# EAGLE schematic MainBoard (EAGLE 6.4)
Modyfikacja testera VFS169

## Sheet 1 of 10
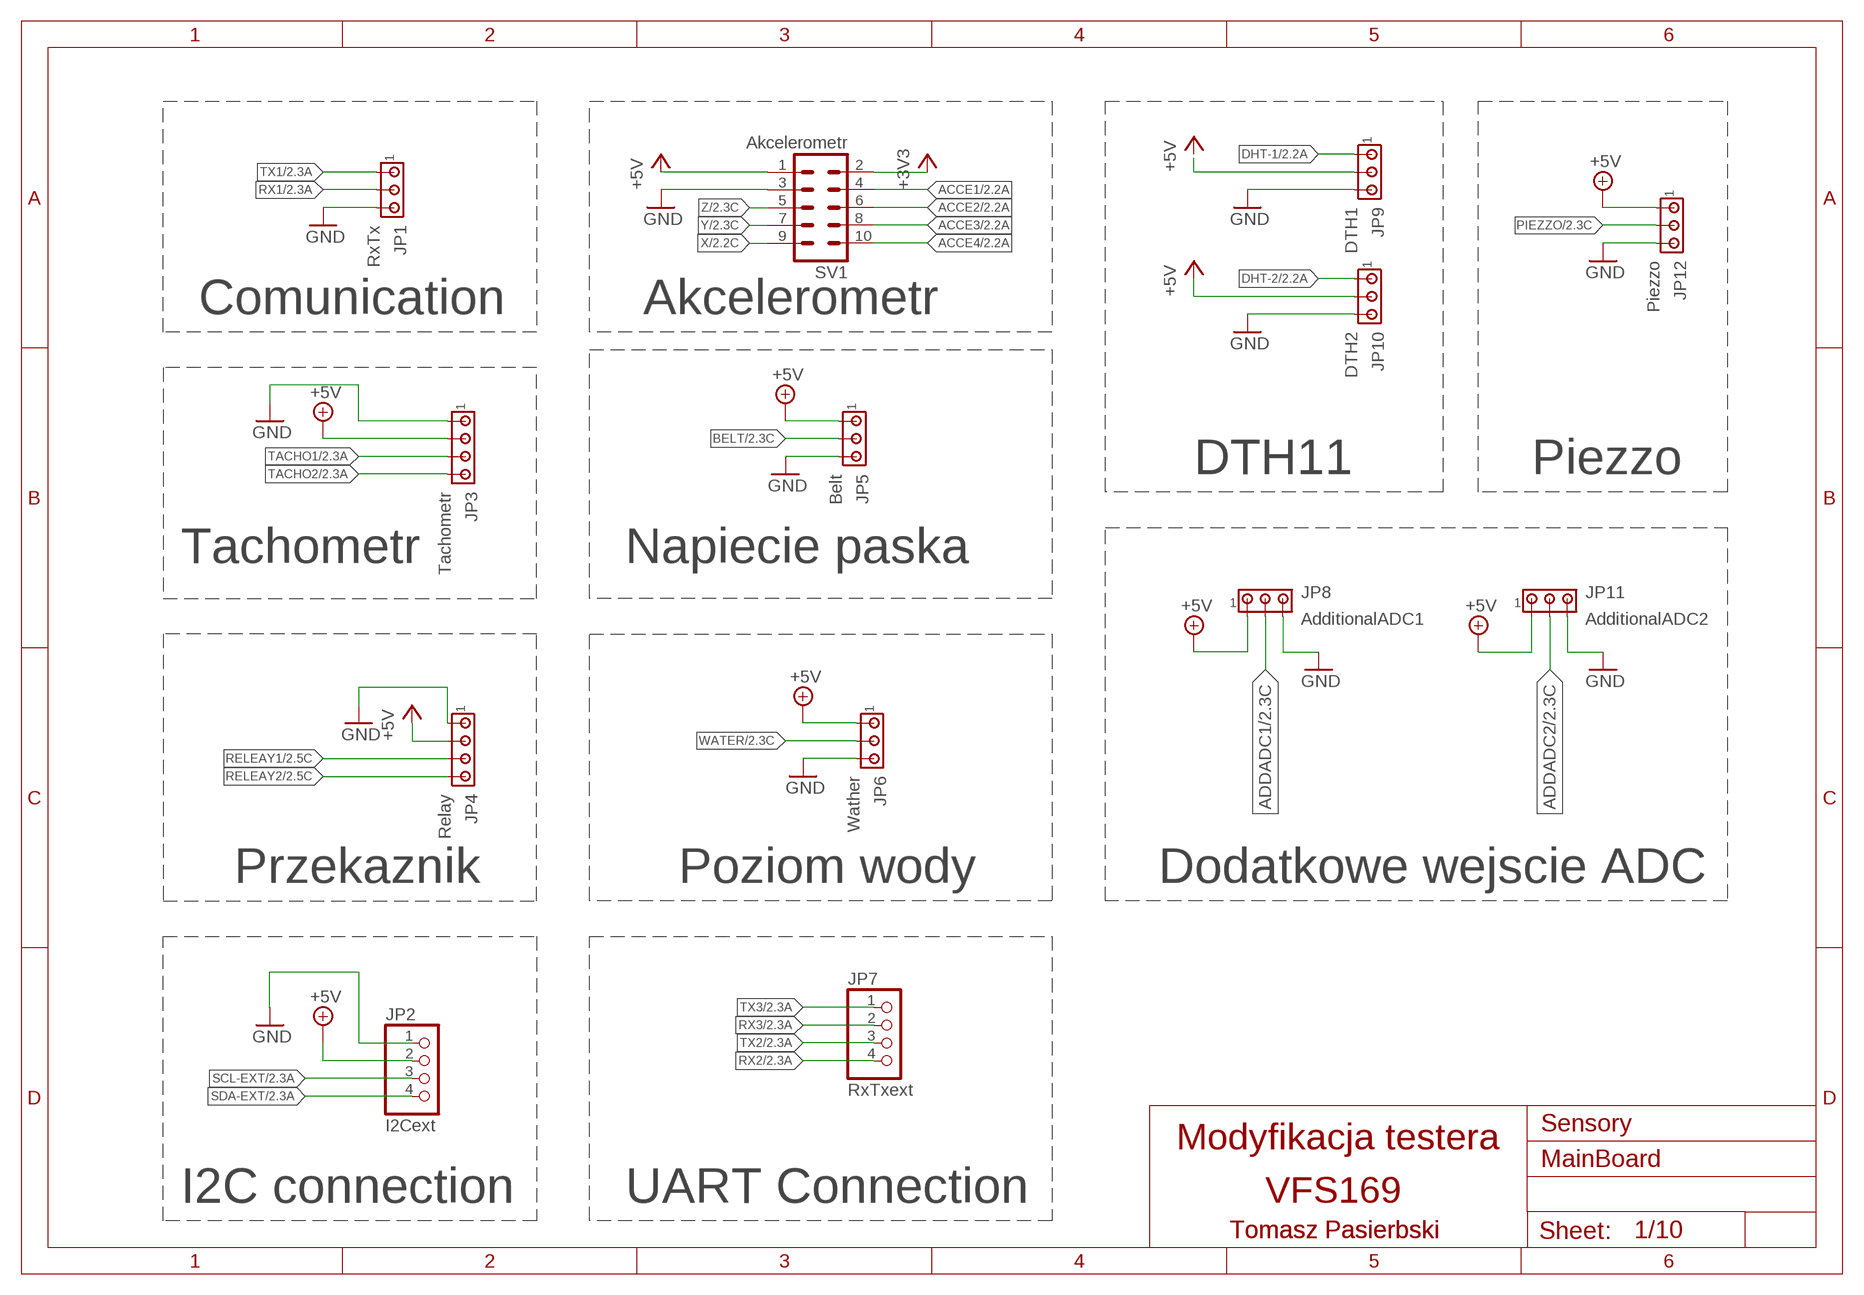
[diagram p0: schematic, sheet 1]

### Parts
JP1  RxTx  MTA03-100  [10X03MTA]
JP2  I2Cext  PINHD-1X4  [1X04]
JP3  Tachometr  MTA04-100  [10X04MTA]
JP4  Relay  MTA04-100  [10X04MTA]
JP5  Belt  MTA03-100  [10X03MTA]
JP6  Wather  MTA03-100  [10X03MTA]
JP7  RxTxext  PINHD-1X4  [1X04]
JP8  AdditionalADC1  MTA03-100  [10X03MTA]
JP9  DTH1  MTA03-100  [10X03MTA]
JP10  DTH2  MTA03-100  [10X03MTA]
JP11  AdditionalADC2  MTA03-100  [10X03MTA]
JP12  Piezzo  MTA03-100  [10X03MTA]
SV1  Akcelerometr  ML10  [ML10]

### Nets
+3V3: SV1.2 ; also sheet 2,7
+5V: JP2.2 JP3.2 JP4.2 JP5.1 JP6.1 JP8.1 JP9.2 JP10.2 JP11.1 JP12.1 SV1.1 ; also sheet 2,3,4,5,6,7,8,9
ACCE1: SV1.4 ; also sheet 2
ACCE2: SV1.6 ; also sheet 2
ACCE3: SV1.8 ; also sheet 2
ACCE4: SV1.10 ; also sheet 2
ADDADC1: JP8.2 ; also sheet 2
ADDADC2: JP11.2 ; also sheet 2
BELT: JP5.2 ; also sheet 2
DHT-1: JP9.1 ; also sheet 2
DHT-2: JP10.1 ; also sheet 2
GND: JP1.3 JP2.1 JP3.1 JP4.1 JP5.3 JP6.3 JP8.3 JP9.3 JP10.3 JP11.3 JP12.3 SV1.3 ; also sheet 2,3,4,5,6,7,8,9
PIEZZO: JP12.2 ; also sheet 2
RELEAY1: JP4.3 ; also sheet 2
RELEAY2: JP4.4 ; also sheet 2
RX1: JP1.2 ; also sheet 2
RX2: JP7.4 ; also sheet 2
RX3: JP7.2 ; also sheet 2
SCL-EXT: JP2.3 ; also sheet 2
SDA-EXT: JP2.4 ; also sheet 2
TACHO1: JP3.3 ; also sheet 2
TACHO2: JP3.4 ; also sheet 2
TX1: JP1.1 ; also sheet 2
TX2: JP7.3 ; also sheet 2
TX3: JP7.1 ; also sheet 2
WATER: JP6.2 ; also sheet 2
X: SV1.9 ; also sheet 2
Y: SV1.7 ; also sheet 2
Z: SV1.5 ; also sheet 2

### Notes on the sheet
- Comunication | Akcelerometr
- DTH11 | Piezzo
- Tachometr | Napiecie paska
- Przekaznik | Poziom wody | Dodatkowe wejscie ADC
- Sensory
- Modyfikacja testera
- I2C connection | UART Connection | VFS169
- Tomasz Pasierbski | Tomasz Pasierbski

## Sheet 2 of 10
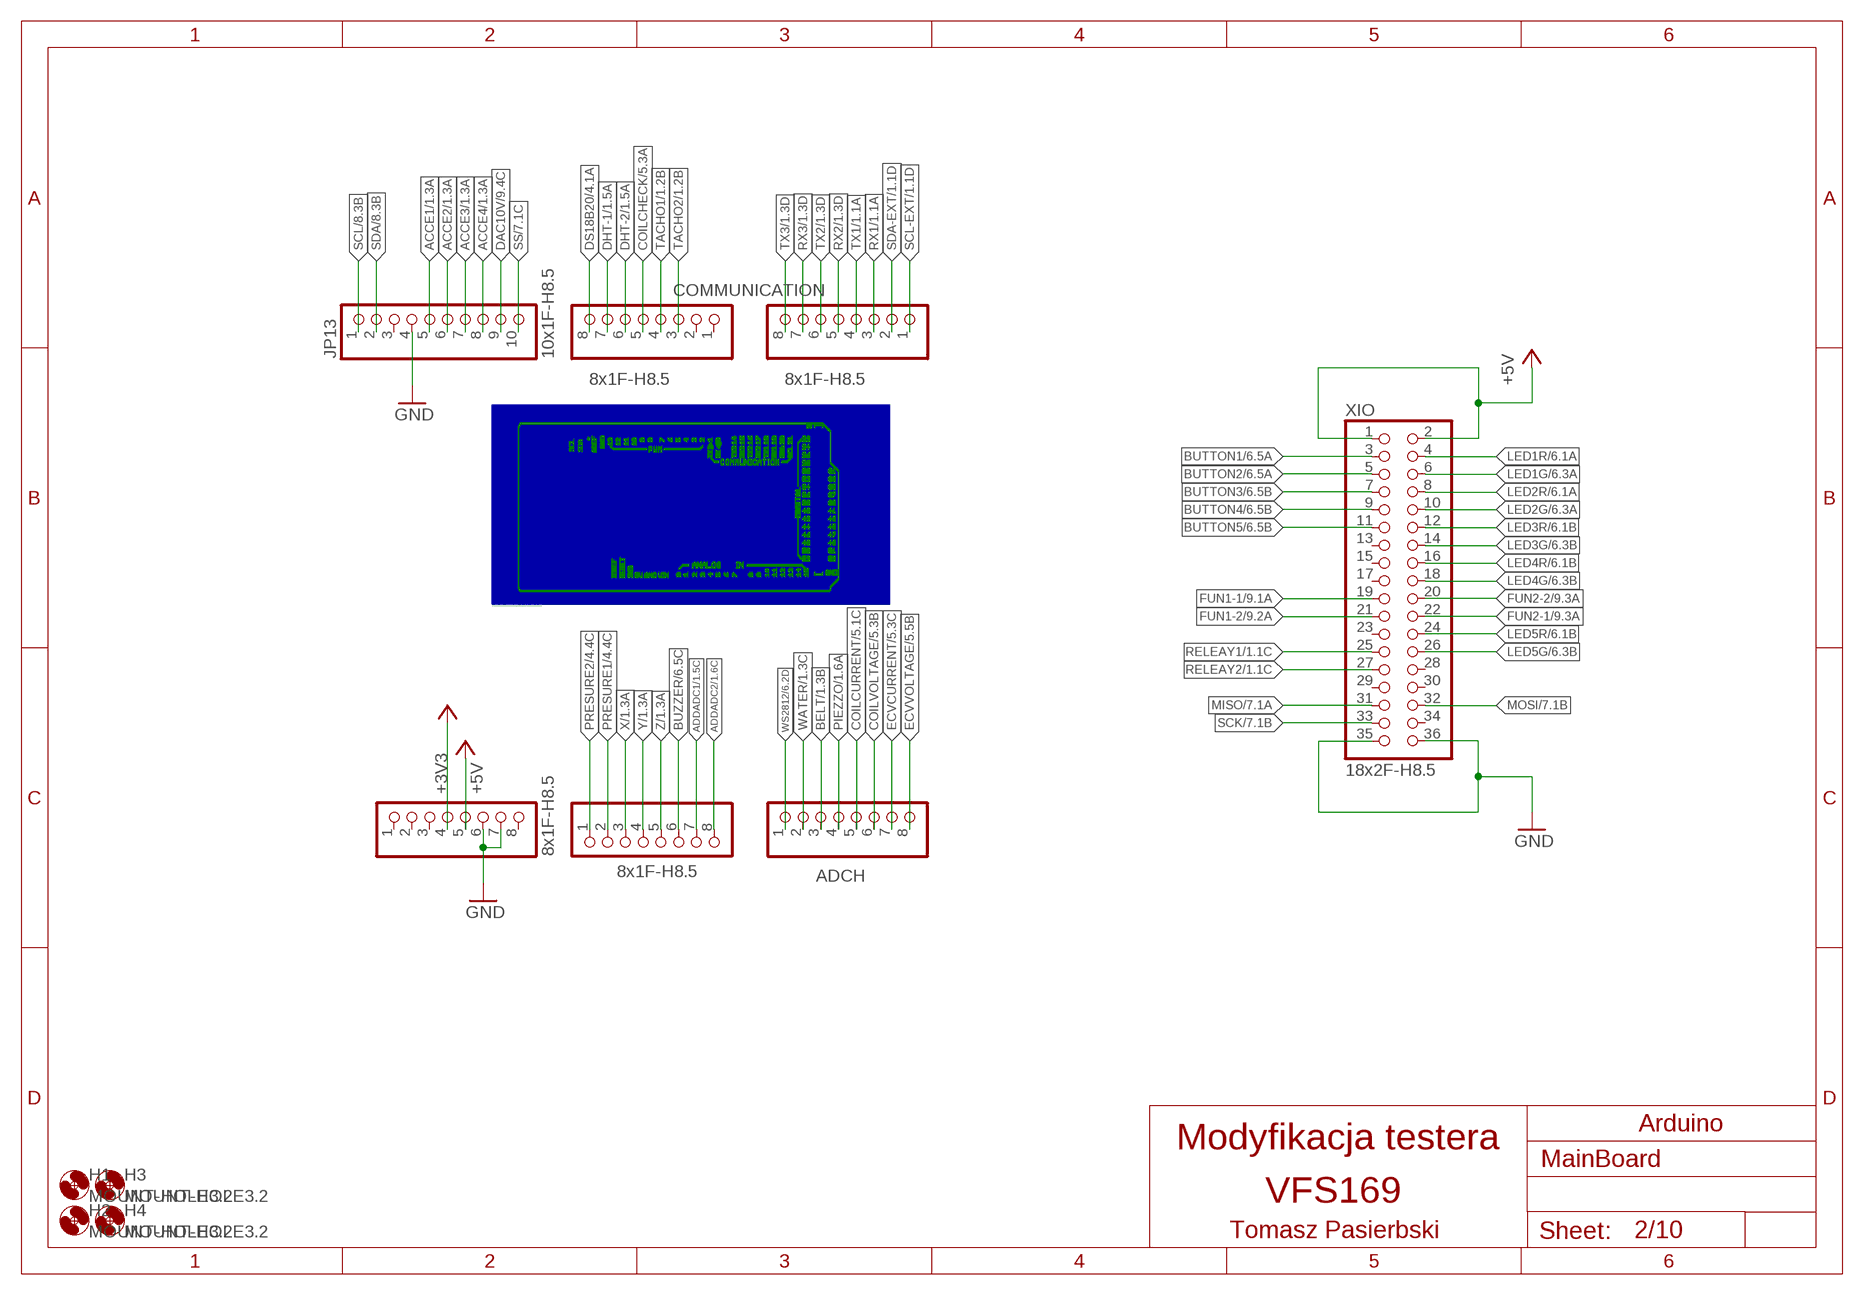
[diagram p1: schematic, sheet 2]

### Parts
ADCH  8x1F-H8.5  PINHD-1X8  [1X08]
ADCL  8x1F-H8.5  PINHD-1X8  [1X08]
COMMUNICATION  8x1F-H8.5  PINHD-1X8  [1X08]
H1  MOUNT-HOLE3.2  [3,2]
H2  MOUNT-HOLE3.2  [3,2]
H3  MOUNT-HOLE3.2  [3,2]
H4  MOUNT-HOLE3.2  [3,2]
JP13  10x1F-H8.5  PINHD-1X10  [1X10]
POWER  8x1F-H8.5  PINHD-1X8  [1X08@1]
PWML  8x1F-H8.5  PINHD-1X8  [1X08]
XIO  18x2F-H8.5  PINHD-2X18  [2X18]

### Nets
+3V3: POWER.4 ; also sheet 1,7
+5V: POWER.5 XIO.1 XIO.2 ; also sheet 1,3,4,5,6,7,8,9
ACCE1: JP13.5 ; also sheet 1
ACCE2: JP13.6 ; also sheet 1
ACCE3: JP13.7 ; also sheet 1
ACCE4: JP13.8 ; also sheet 1
ADDADC1: ADCL.7 ; also sheet 1
ADDADC2: ADCL.8 ; also sheet 1
BELT: ADCH.3 ; also sheet 1
BUTTON1: XIO.3 ; also sheet 6
BUTTON2: XIO.5 ; also sheet 6
BUTTON3: XIO.7 ; also sheet 6
BUTTON4: XIO.9 ; also sheet 6
BUTTON5: XIO.11 ; also sheet 6
BUZZER: ADCL.6 ; also sheet 6
COILCHECK: PWML.5 ; also sheet 5
COILCURRENT: ADCH.5 ; also sheet 5
COILVOLTAGE: ADCH.6 ; also sheet 5
DAC10V: JP13.9 ; also sheet 9
DHT-1: PWML.7 ; also sheet 1
DHT-2: PWML.6 ; also sheet 1
DS18B20: PWML.8 ; also sheet 4
ECVCURRENT: ADCH.7 ; also sheet 5
ECVVOLTAGE: ADCH.8 ; also sheet 5
FUN1-1: XIO.19 ; also sheet 9
FUN1-2: XIO.21 ; also sheet 9
FUN2-1: XIO.22 ; also sheet 9
FUN2-2: XIO.20 ; also sheet 9
GND: JP13.4 POWER.6 POWER.7 XIO.35 XIO.36 ; also sheet 1,3,4,5,6,7,8,9
LED1G: XIO.6 ; also sheet 6
LED1R: XIO.4 ; also sheet 6
LED2G: XIO.10 ; also sheet 6
LED2R: XIO.8 ; also sheet 6
LED3G: XIO.14 ; also sheet 6
LED3R: XIO.12 ; also sheet 6
LED4G: XIO.18 ; also sheet 6
LED4R: XIO.16 ; also sheet 6
LED5G: XIO.26 ; also sheet 6
LED5R: XIO.24 ; also sheet 6
MISO: XIO.31 ; also sheet 7
MOSI: XIO.32 ; also sheet 7
PIEZZO: ADCH.4 ; also sheet 1
PRESURE1: ADCL.2 ; also sheet 4
PRESURE2: ADCL.1 ; also sheet 4
RELEAY1: XIO.25 ; also sheet 1
RELEAY2: XIO.27 ; also sheet 1
RX1: COMMUNICATION.3 ; also sheet 1
RX2: COMMUNICATION.5 ; also sheet 1
RX3: COMMUNICATION.7 ; also sheet 1
SCK: XIO.33 ; also sheet 7
SCL: JP13.1 ; also sheet 8
SCL-EXT: COMMUNICATION.1 ; also sheet 1
SDA: JP13.2 ; also sheet 8
SDA-EXT: COMMUNICATION.2 ; also sheet 1
SS: JP13.10 ; also sheet 7
TACHO1: PWML.4 ; also sheet 1
TACHO2: PWML.3 ; also sheet 1
TX1: COMMUNICATION.4 ; also sheet 1
TX2: COMMUNICATION.6 ; also sheet 1
TX3: COMMUNICATION.8 ; also sheet 1
WATER: ADCH.2 ; also sheet 1
WS2812: ADCH.1 ; also sheet 6
X: ADCL.3 ; also sheet 1
Y: ADCL.4 ; also sheet 1
Z: ADCL.5 ; also sheet 1
Unconnected: JP13.3 POWER.1 POWER.2 POWER.3 POWER.8 PWML.1 PWML.2 XIO.13 XIO.15 XIO.17 XIO.23 XIO.28 XIO.29 XIO.30 XIO.34

### Notes on the sheet
- C:/Users/Tomek/Documents/eagle/Modyfikacja Testera/ard.bmp
- Arduino
- Modyfikacja testera
- VFS169
- Tomasz Pasierbski

## Sheet 3 of 10
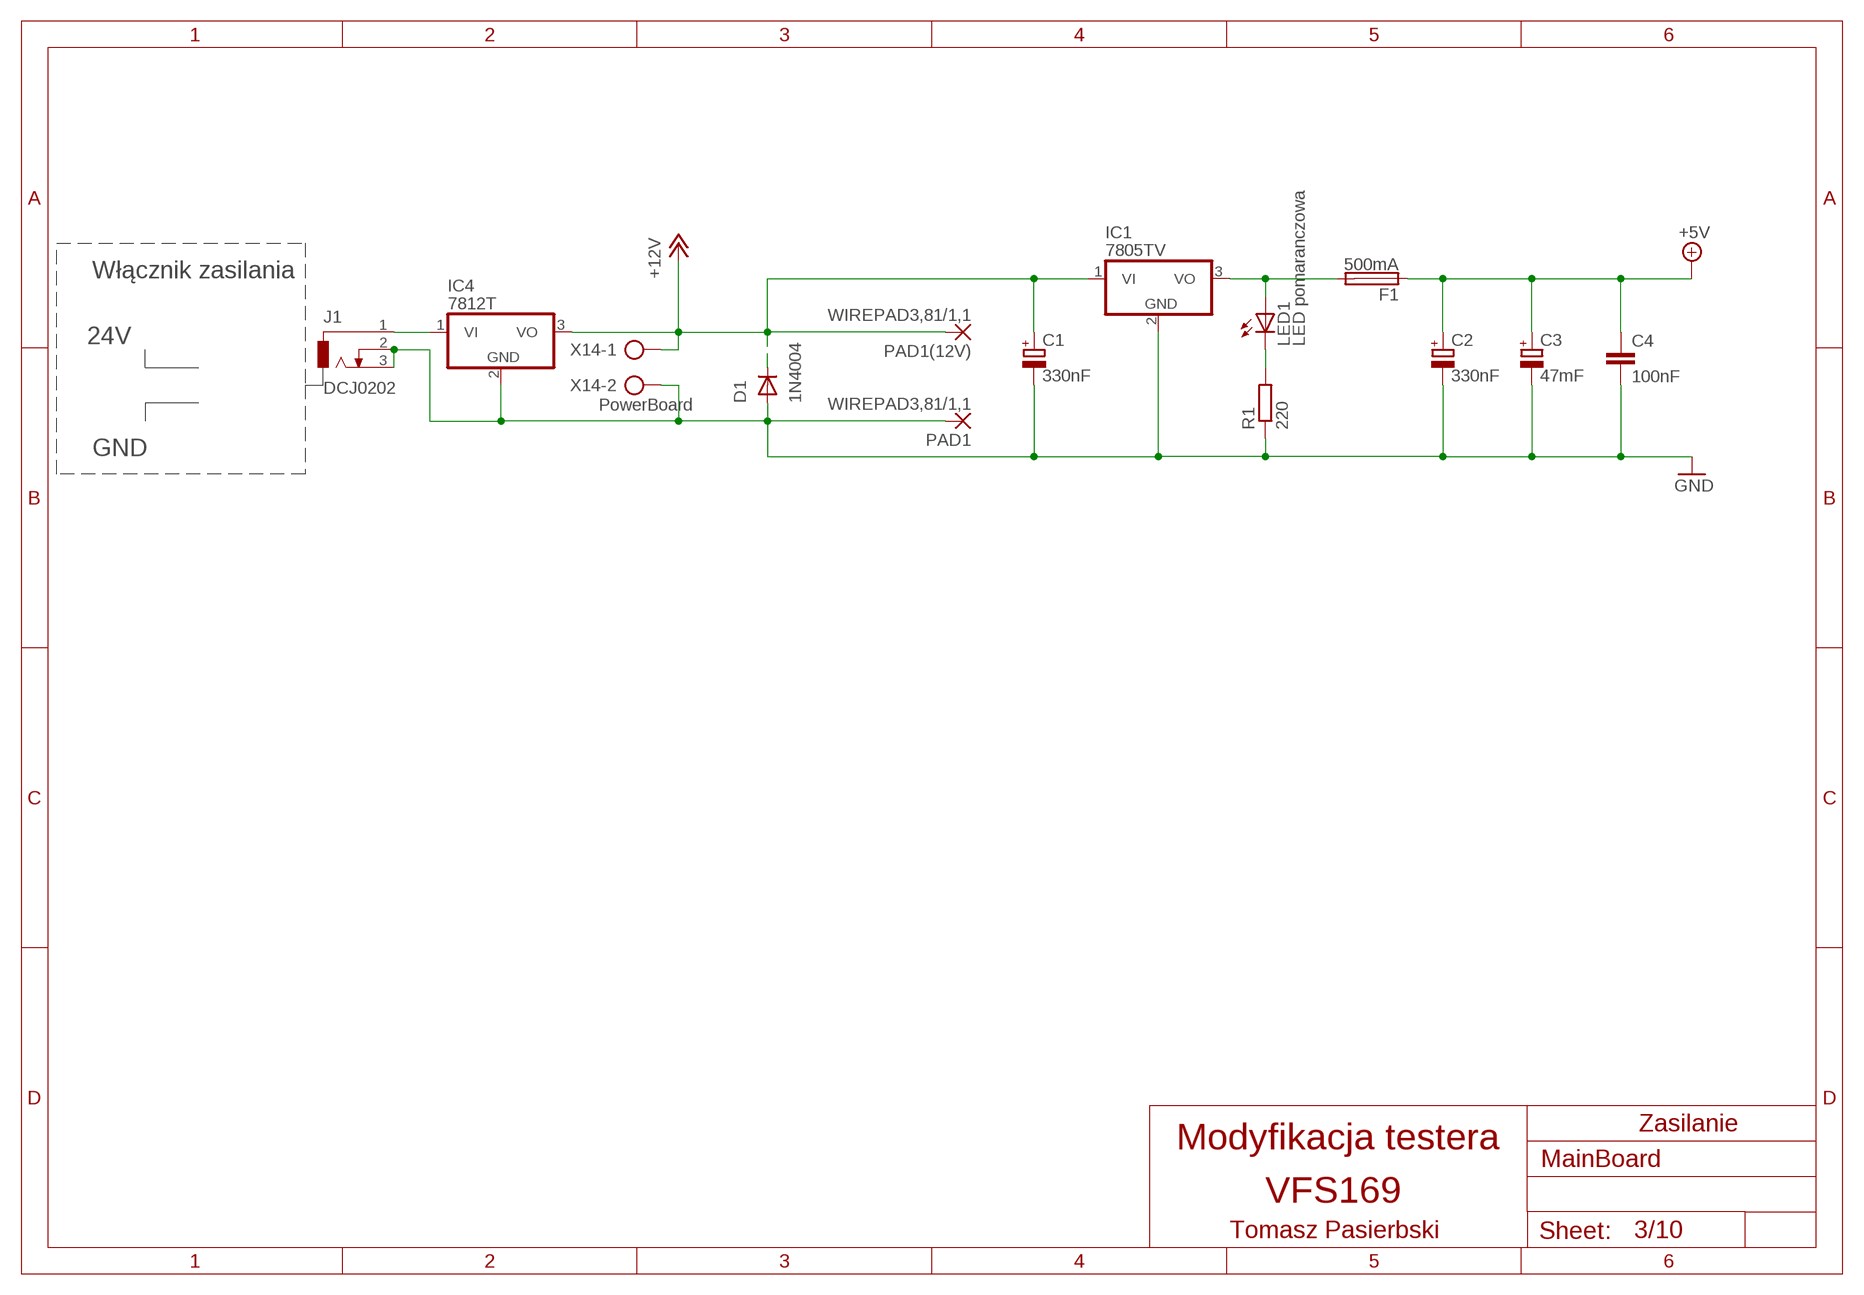
[diagram p2: schematic, sheet 3]

### Parts
C1  330nF  CPOL-EUE3.5-10  [E3,5-10]
C2  330nF  CPOL-EUE3.5-10  [E3,5-10]
C3  47mF  CPOL-EUE2.5-6  [E2,5-6]
C4  100nF  C-EU025-030X050  [C025-030X050]
D1  1N4004  [DO41-10]
F1  500mA  FUSESH22,5A  [SH22,5A]
IC1  7805TV  [TO220V]
IC4  7812T  [TO220H]
J1  DCJ0202  [DCJ0202]
LED1  LED pomaranczowa  LED5MM  [LED5MM]
PAD1  WIREPAD3,81/1,1  [3,81/1,1]
PAD1(12V)  WIREPAD3,81/1,1  [3,81/1,1]
R1  220  R-EU_0204/7  [0204/7]
X14  PowerBoard  AK300/2  [AK300/2]

### Nets
+5V: C2.+ C3.+ C4.1 F1.1 ; also sheet 1,2,4,5,6,7,8,9
+12V: C1.+ D1.C IC1.1(VI) IC4.3(VO) PAD1(12V).1(P) X14.1 ; also sheet 4
GND: C1.- C2.- C3.- C4.2 D1.A IC1.2(GND) IC4.2(GND) J1.2 J1.3 PAD1.1(P) R1.1 X14.2 ; also sheet 1,2,4,5,6,7,8,9
N$5: F1.2 IC1.3(VO) LED1.A
N$30: LED1.K(C) R1.2
N$33: IC4.1(VI) J1.1

### Notes on the sheet
- Włącznik zasilania
- 24V
- GND
- Zasilanie
- Modyfikacja testera
- VFS169
- Tomasz Pasierbski

## Sheet 4 of 10
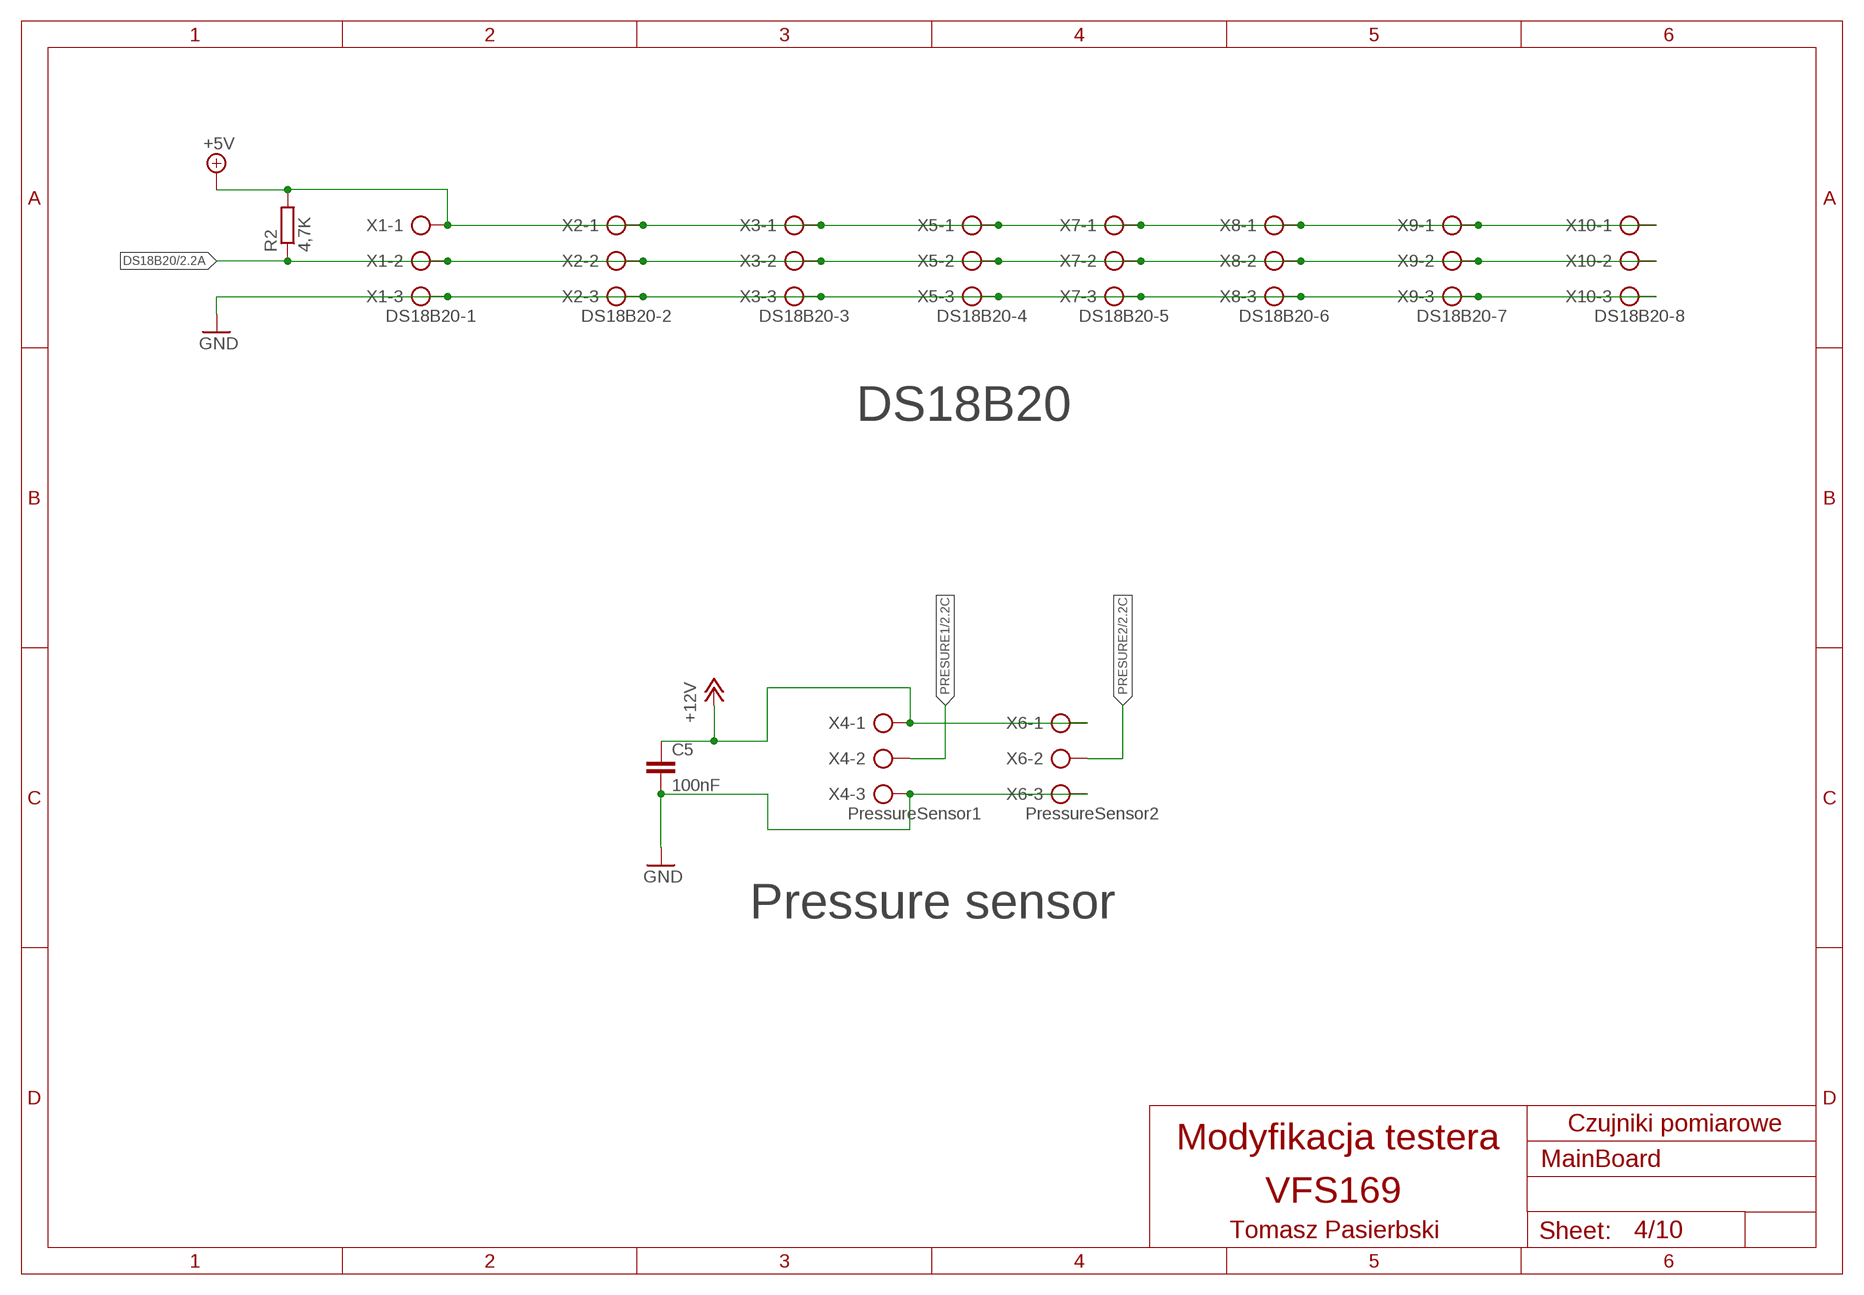
[diagram p3: schematic, sheet 4]

### Parts
C5  100nF  C-EU075-032X103  [C075-032X103]
R2  4,7K  R-EU_0207/12  [0207/12]
X1  DS18B20-1  AK300/3  [AK300/3]
X2  DS18B20-2  AK300/3  [AK300/3]
X3  DS18B20-3  AK300/3  [AK300/3]
X4  PressureSensor1  AK300/3  [AK300/3]
X5  DS18B20-4  AK300/3  [AK300/3]
X6  PressureSensor2  AK300/3  [AK300/3]
X7  DS18B20-5  AK300/3  [AK300/3]
X8  DS18B20-6  AK300/3  [AK300/3]
X9  DS18B20-7  AK300/3  [AK300/3]
X10  DS18B20-8  AK300/3  [AK300/3]

### Nets
+5V: R2.2 X1.1 X2.1 X3.1 X5.1 X7.1 X8.1 X9.1 X10.1 ; also sheet 1,2,3,5,6,7,8,9
+12V: C5.1 X4.1 X6.1 ; also sheet 3
DS18B20: R2.1 X1.2 X2.2 X3.2 X5.2 X7.2 X8.2 X9.2 X10.2 ; also sheet 2
GND: C5.2 X1.3 X2.3 X3.3 X4.3 X5.3 X6.3 X7.3 X8.3 X9.3 X10.3 ; also sheet 1,2,3,5,6,7,8,9
PRESURE1: X4.2 ; also sheet 2
PRESURE2: X6.2 ; also sheet 2

### Notes on the sheet
- DS18B20
- Pressure sensor
- Czujniki pomiarowe
- Modyfikacja testera
- VFS169
- Tomasz Pasierbski

## Sheet 5 of 10
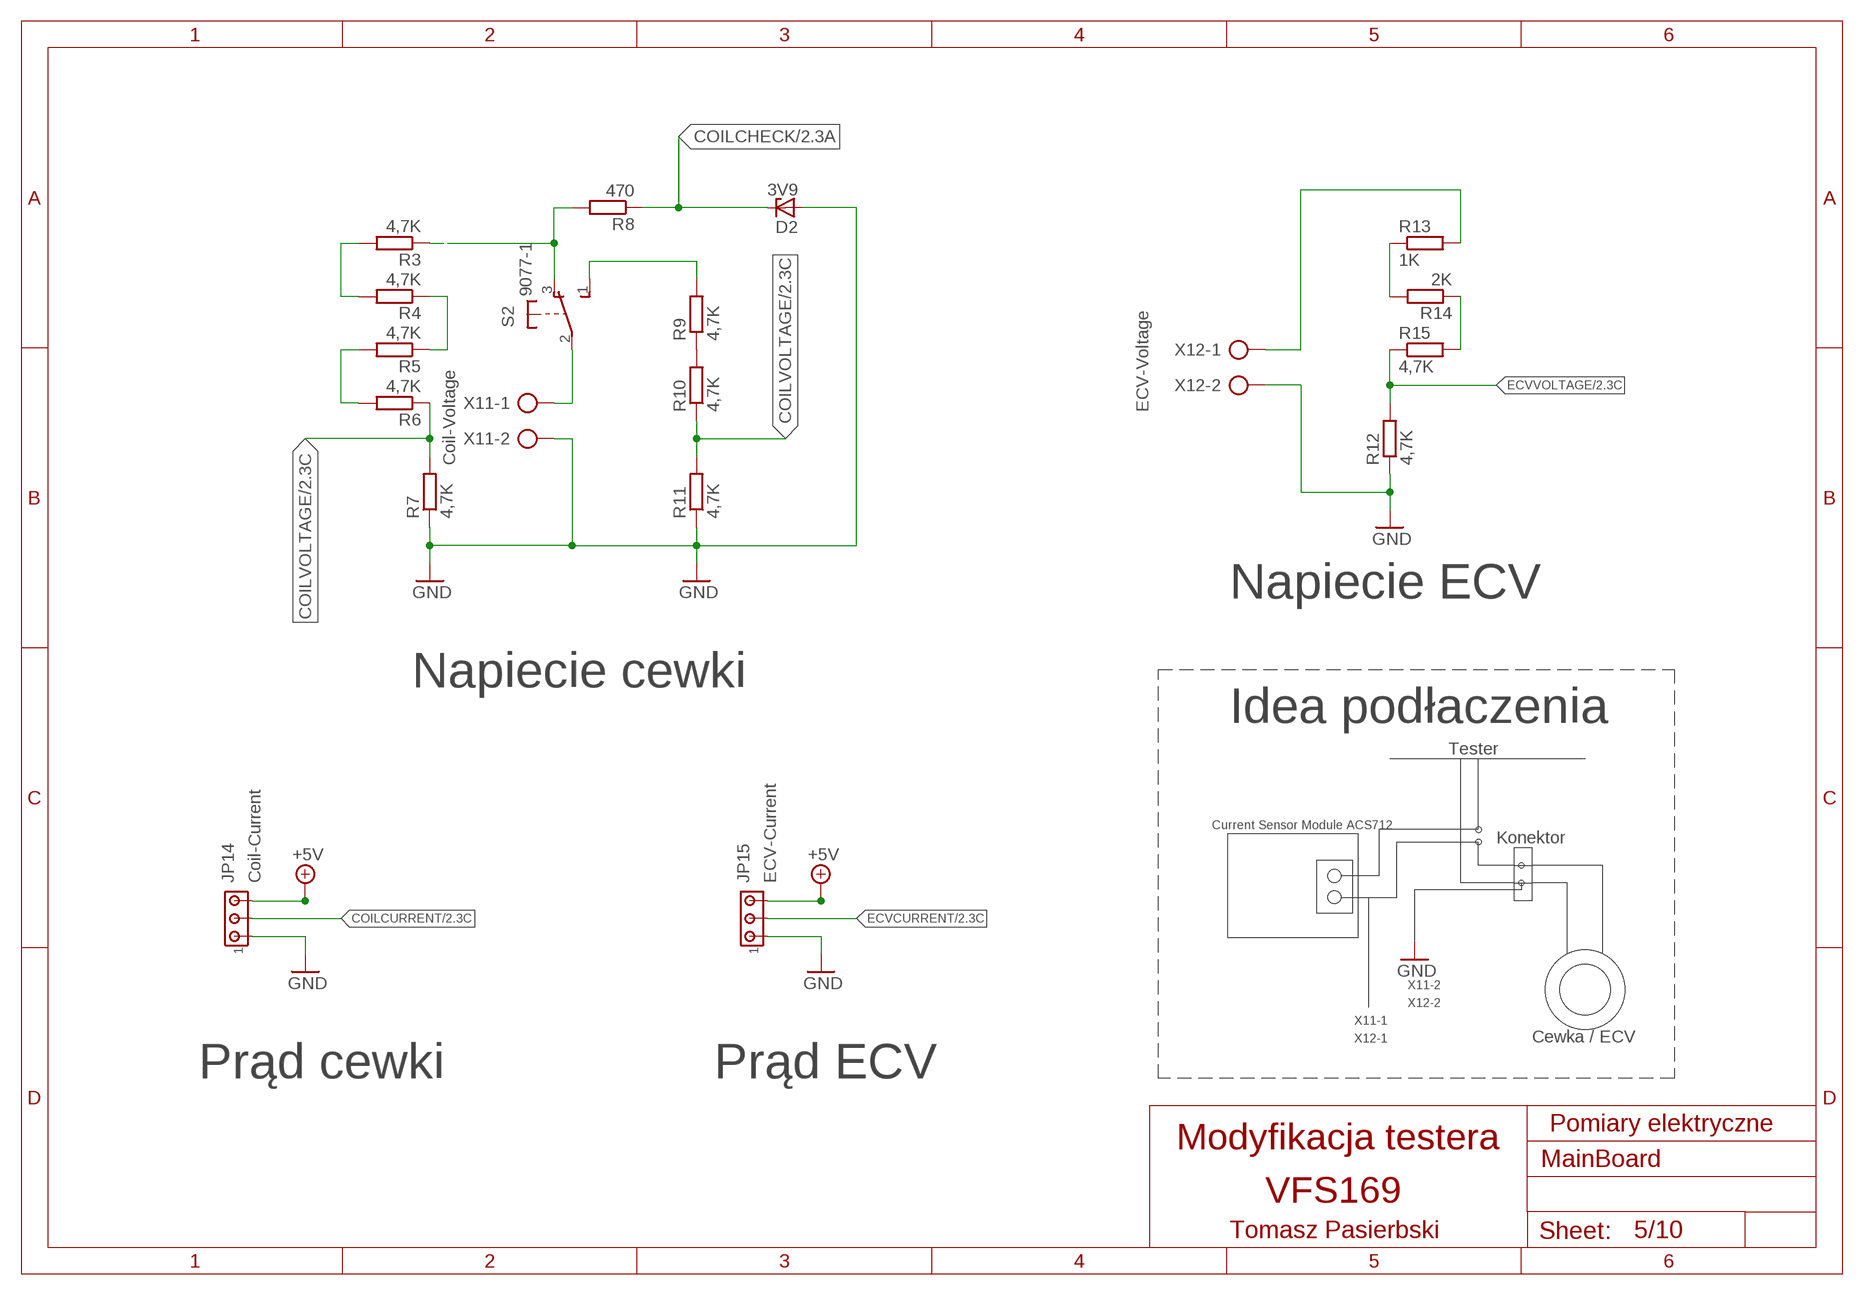
[diagram p4: schematic, sheet 5]

### Parts
D2  3V9  ZENER-DIODEZD-7.5  [ZDIO-7.5]
JP14  Coil-Current  MTA03-100  [10X03MTA]
JP15  ECV-Current  MTA03-100  [10X03MTA]
R3  4,7K  R-EU_0207/10  [0207/10]
R4  4,7K  R-EU_0207/10  [0207/10]
R5  4,7K  R-EU_0207/10  [0207/10]
R6  4,7K  R-EU_0207/10  [0207/10]
R7  4,7K  R-EU_0207/10  [0207/10]
R8  470  R-EU_0207/10  [0207/10]
R9  4,7K  R-EU_0207/10  [0207/10]
R10  4,7K  R-EU_0207/10  [0207/10]
R11  4,7K  R-EU_0207/10  [0207/10]
R12  4,7K  R-EU_0207/10  [0207/10]
R13  1K  R-EU_0207/10  [0207/10]
R14  2K  R-EU_0207/10  [0207/10]
R15  4,7K  R-EU_0207/10  [0207/10]
S2  9077-1  [9077-1]
X11  Coil-Voltage  AK300/2  [AK300/2]
X12  ECV-Voltage  AK300/2  [AK300/2]

### Nets
+5V: JP14.3 JP15.3 ; also sheet 1,2,3,4,6,7,8,9
COILCHECK: D2.C R8.1 ; also sheet 2
COILCURRENT: JP14.2 ; also sheet 2
COILVOLTAGE: R6.1 R7.2 R10.1 R11.2 ; also sheet 2
ECVCURRENT: JP15.2 ; also sheet 2
ECVVOLTAGE: R12.2 R15.1 ; also sheet 2
GND: D2.A JP14.1 JP15.1 R7.1 R11.1 R12.1 X11.2 X12.2 ; also sheet 1,2,3,4,6,7,8,9
N$1: R9.2 S2.1(S)
N$3: R3.1 R8.2 S2.3(O)
N$4: S2.2(P) X11.1
N$8: R13.2 X12.1
N$9: R9.1 R10.2
N$10: R5.2 R6.2
N$22: R4.1 R5.1
N$23: R3.2 R4.2
N$28: R14.1 R15.2
N$29: R13.1 R14.2

### Notes on the sheet
- Napiecie ECV
- Napiecie cewki
- Idea podłaczenia
- Tester
- Current Sensor Module ACS712
- Konektor
- X11-2
- X12-2
- X11-1
- X12-1 | Cewka / ECV
- Prąd cewki | Prąd ECV
- Pomiary elektryczne
- Modyfikacja testera
- VFS169
- Tomasz Pasierbski

## Sheet 6 of 10
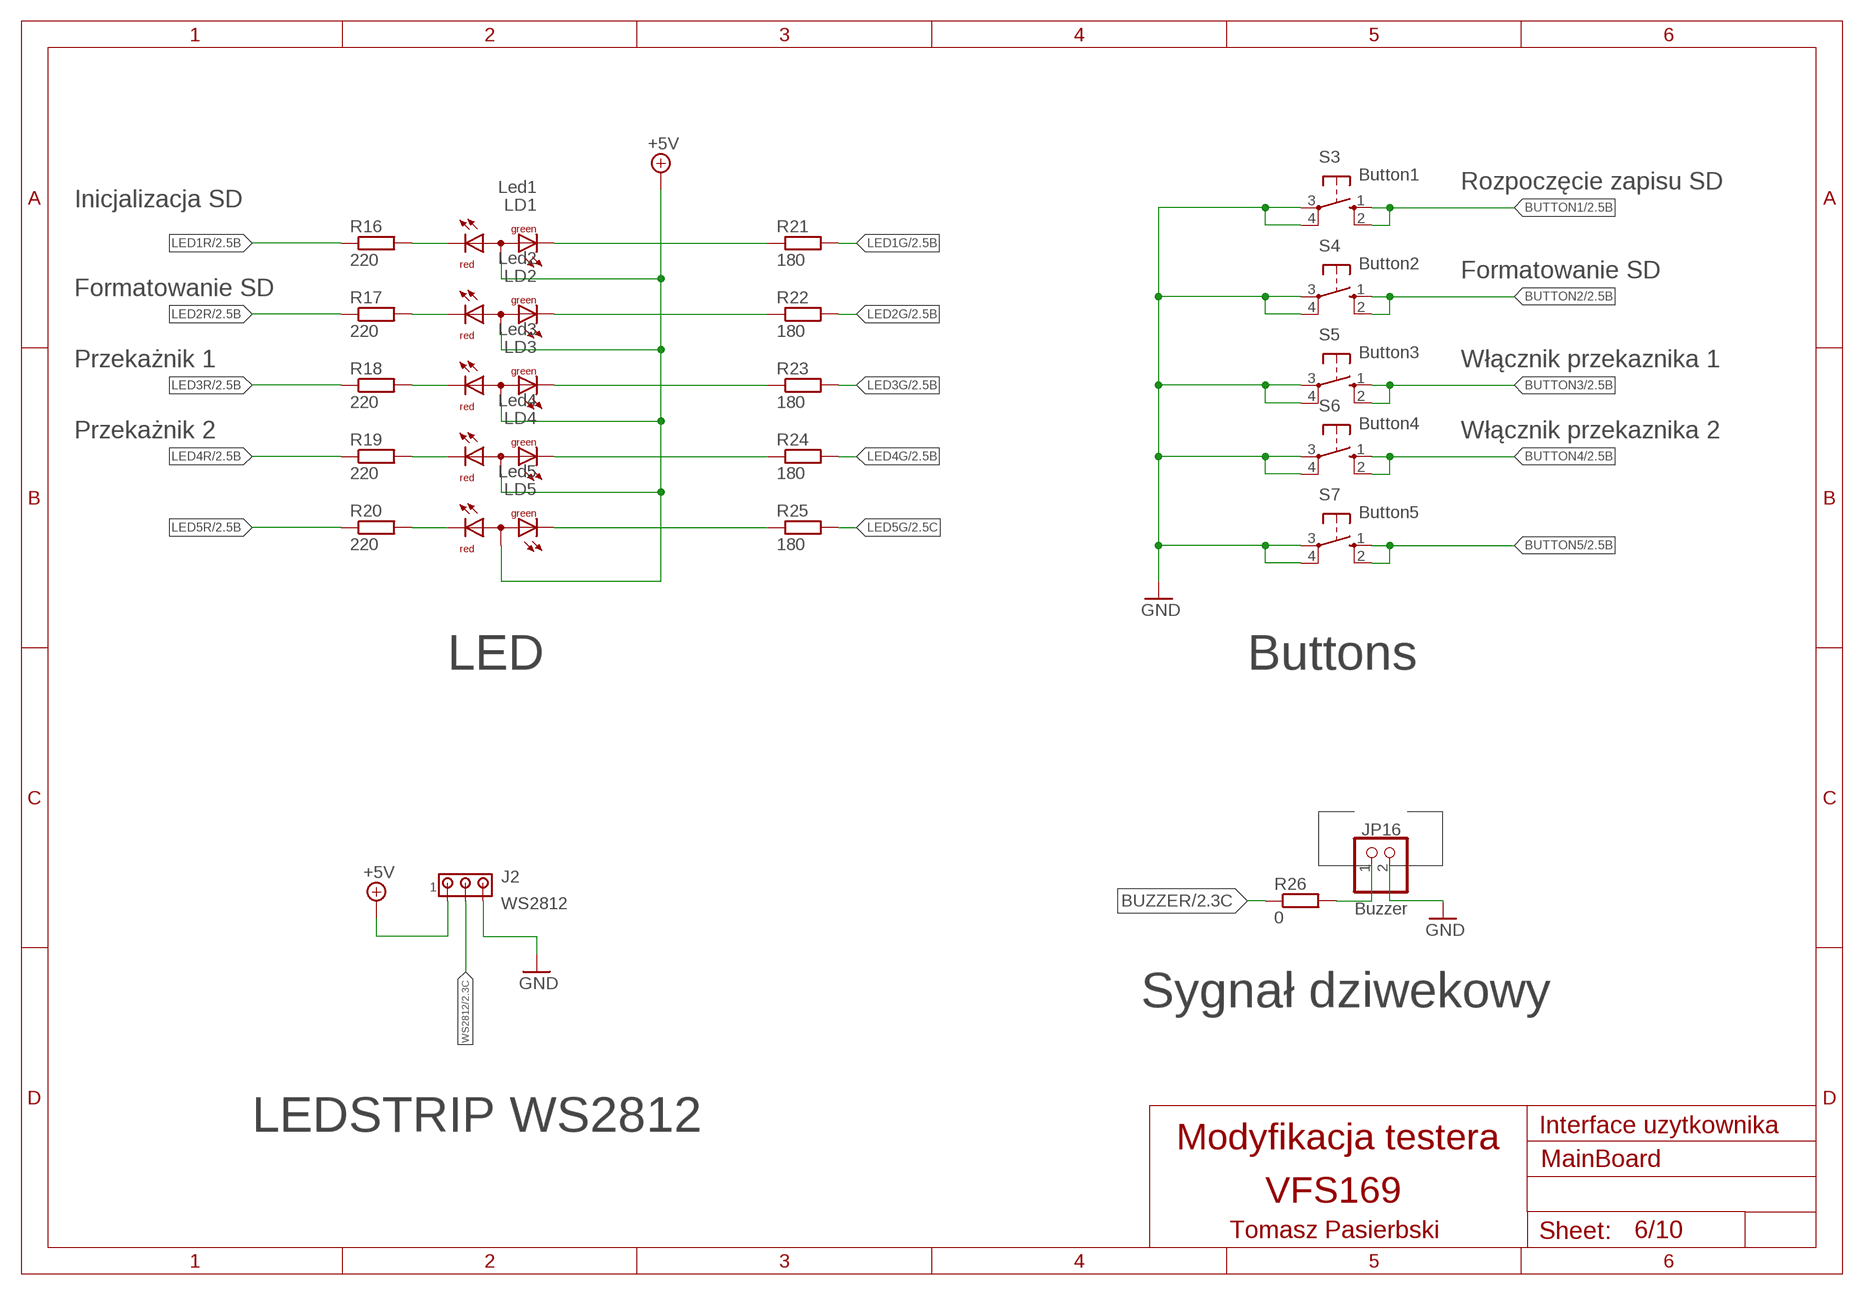
[diagram p5: schematic, sheet 6]

### Parts
J2  WS2812  MTA03-100  [10X03MTA]
JP16  Buzzer  PINHD-1X2  [1X02]
LD1  Led1  DUOLED-RG-A  [DUOLED-A-5MM]
LD2  Led2  DUOLED-RG-A  [DUOLED-A-5MM]
LD3  Led3  DUOLED-RG-A  [DUOLED-A-5MM]
LD4  Led4  DUOLED-RG-A  [DUOLED-A-5MM]
LD5  Led5  DUOLED-RG-A  [DUOLED-A-5MM]
R16  220  R-EU_0204/7  [0204/7]
R17  220  R-EU_0204/7  [0204/7]
R18  220  R-EU_0204/7  [0204/7]
R19  220  R-EU_0204/7  [0204/7]
R20  220  R-EU_0204/7  [0204/7]
R21  180  R-EU_0204/7  [0204/7]
R22  180  R-EU_0204/7  [0204/7]
R23  180  R-EU_0204/7  [0204/7]
R24  180  R-EU_0204/7  [0204/7]
R25  180  R-EU_0204/7  [0204/7]
R26  0  R-EU_0207/10  [0207/10]
S3  Button1  10-XX  [B3F-10XX]
S4  Button2  10-XX  [B3F-10XX]
S5  Button3  10-XX  [B3F-10XX]
S6  Button4  10-XX  [B3F-10XX]
S7  Button5  10-XX  [B3F-10XX]

### Nets
+5V: J2.1 LD1.A LD2.A LD3.A LD4.A LD5.A ; also sheet 1,2,3,4,5,7,8,9
BUTTON1: S3.1(S) S3.2(S1) ; also sheet 2
BUTTON2: S4.1(S) S4.2(S1) ; also sheet 2
BUTTON3: S5.1(S) S5.2(S1) ; also sheet 2
BUTTON4: S6.1(S) S6.2(S1) ; also sheet 2
BUTTON5: S7.1(S) S7.2(S1) ; also sheet 2
BUZZER: R26.1 ; also sheet 2
GND: J2.3 JP16.2 S3.3(P) S3.4(P1) S4.3(P) S4.4(P1) S5.3(P) S5.4(P1) S6.3(P) S6.4(P1) S7.3(P) S7.4(P1) ; also sheet 1,2,3,4,5,7,8,9
LED1G: R21.2 ; also sheet 2
LED1R: R16.1 ; also sheet 2
LED2G: R22.2 ; also sheet 2
LED2R: R17.1 ; also sheet 2
LED3G: R23.2 ; also sheet 2
LED3R: R18.1 ; also sheet 2
LED4G: R24.2 ; also sheet 2
LED4R: R19.1 ; also sheet 2
LED5G: R25.2 ; also sheet 2
LED5R: R20.1 ; also sheet 2
N$11: LD1.CR R16.2
N$12: LD2.CR R17.2
N$13: LD3.CR R18.2
N$14: LD4.CR R19.2
N$15: LD5.CR R20.2
N$16: LD5.CX(CG) R25.1
N$17: LD4.CX(CG) R24.1
N$18: LD3.CX(CG) R23.1
N$19: LD2.CX(CG) R22.1
N$20: LD1.CX(CG) R21.1
N$31: JP16.1 R26.2
WS2812: J2.2 ; also sheet 2

### Notes on the sheet
- Rozpoczęcie zapisu SD
- Inicjalizacja SD
- Formatowanie SD
- Formatowanie SD
- Przekażnik 1 | Włącznik przekaznika 1
- Przekażnik 2 | Włącznik przekaznika 2
- LED | Buttons
- Sygnał dziwekowy
- LEDSTRIP WS2812 | Interface uzytkownika
- Modyfikacja testera
- VFS169
- Tomasz Pasierbski

## Sheet 7 of 10
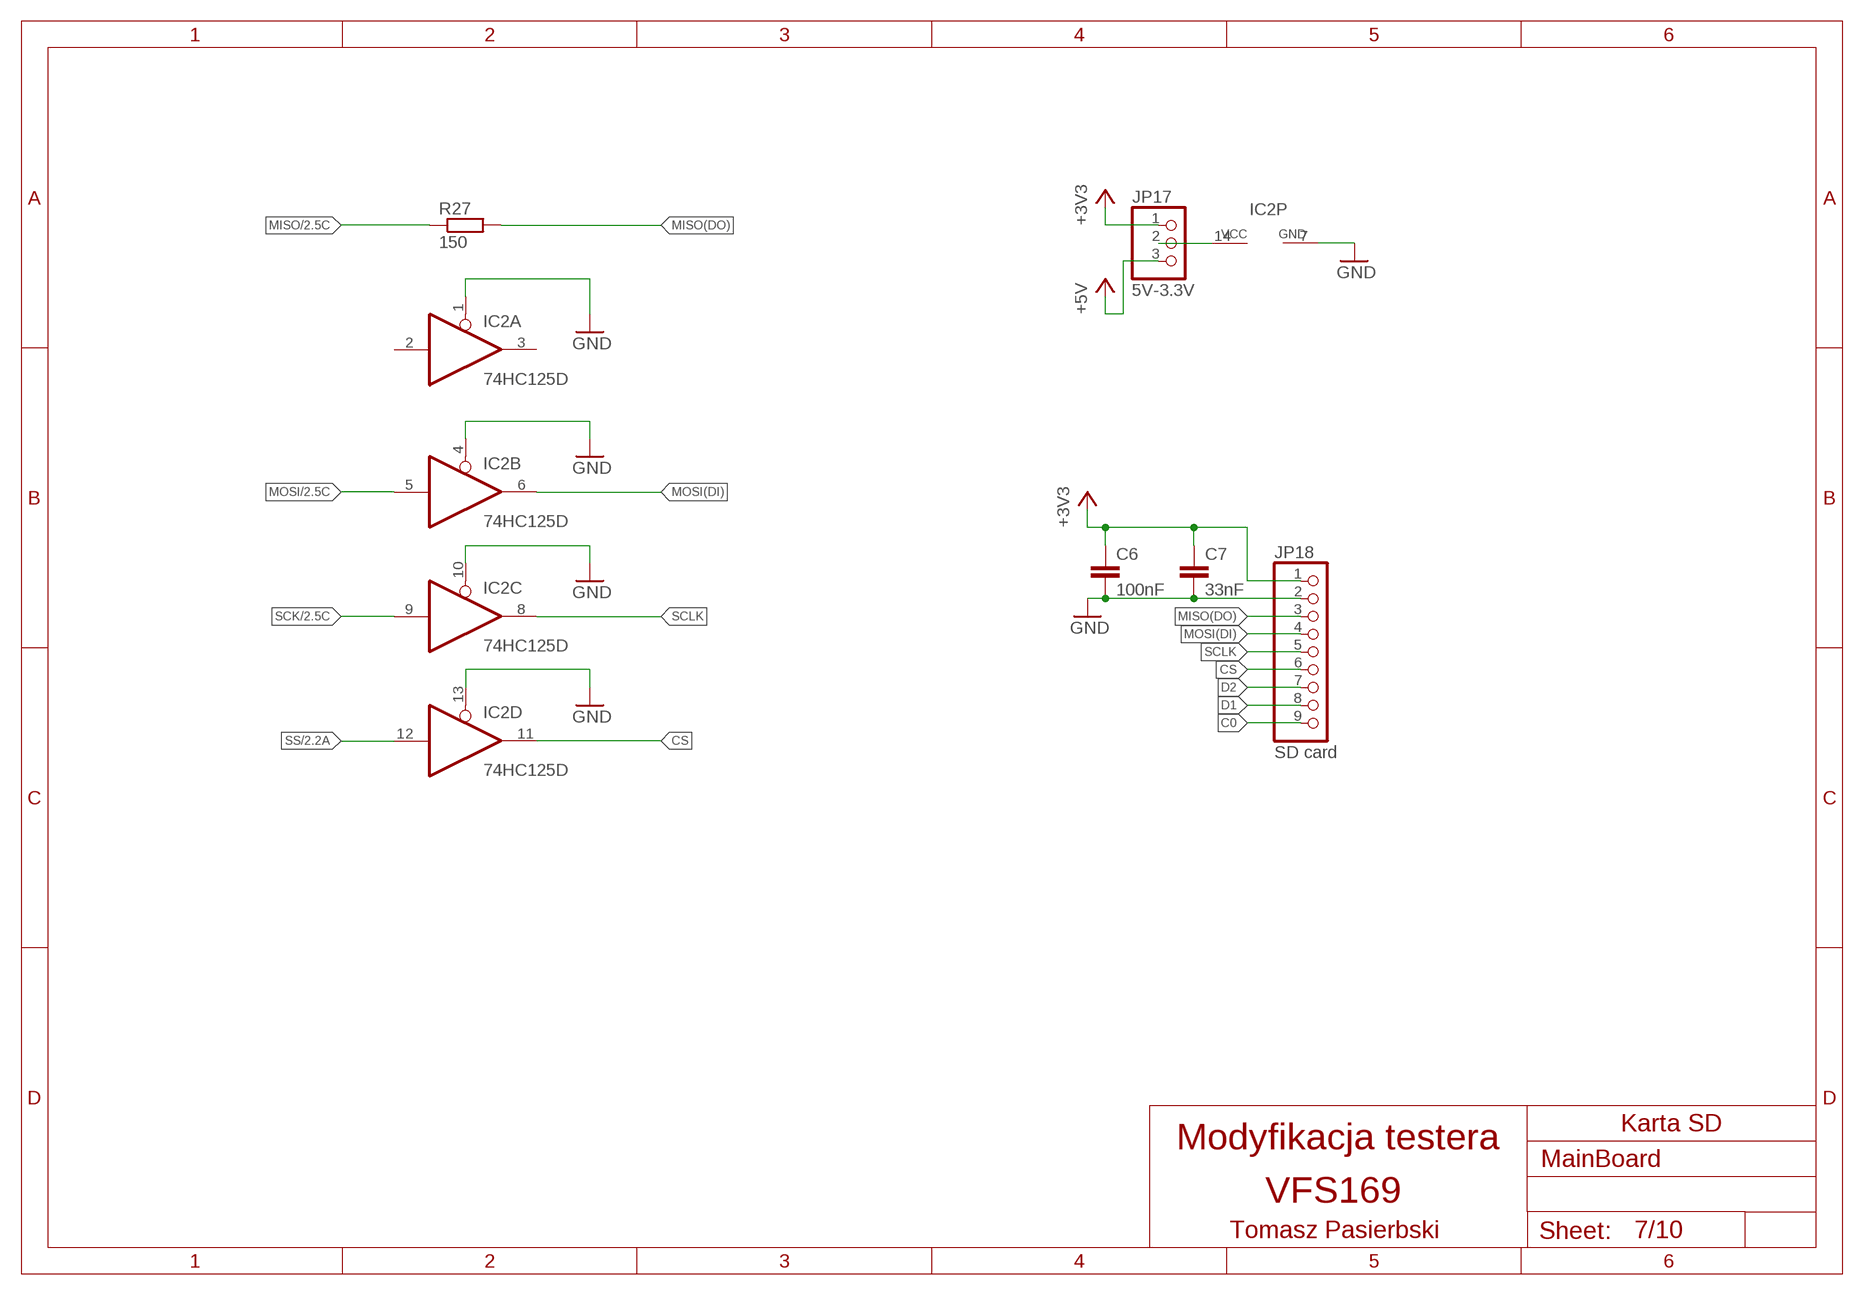
[diagram p6: schematic, sheet 7]

### Parts
C6  100nF  C-EU025-030X050  [C025-030X050]
C7  33nF  C-EU025-024X044  [C025-024X044]
IC2  74HC125D  [SO14]
JP17  5V-3.3V  PINHD-1X3  [1X03]
JP18  SD card  PINHD-1X9  [1X09]
R27  150  R-EU_0204/7  [0204/7]

### Nets
+3V3: C6.1 C7.1 JP17.1 JP18.1 ; also sheet 1,2
+5V: JP17.3 ; also sheet 1,2,3,4,5,6,8,9
C0: JP18.9
CS: IC2.11(D:O) JP18.6
D1: JP18.8
D2: JP18.7
GND: C6.2 C7.2 IC2.1(A:OE) IC2.4(B:OE) IC2.7(P:GND) IC2.10(C:OE) IC2.13(D:OE) JP18.2 ; also sheet 1,2,3,4,5,6,8,9
MISO: R27.1 ; also sheet 2
MISO(DO): JP18.3 R27.2
MOSI: IC2.5(B:I) ; also sheet 2
MOSI(DI): IC2.6(B:O) JP18.4
N$27: IC2.14(P:VCC) JP17.2
SCK: IC2.9(C:I) ; also sheet 2
SCLK: IC2.8(C:O) JP18.5
SS: IC2.12(D:I) ; also sheet 2
Unconnected: IC2.2(A:I) IC2.3(A:O)

### Notes on the sheet
- Karta SD
- Modyfikacja testera
- VFS169
- Tomasz Pasierbski

## Sheet 8 of 10
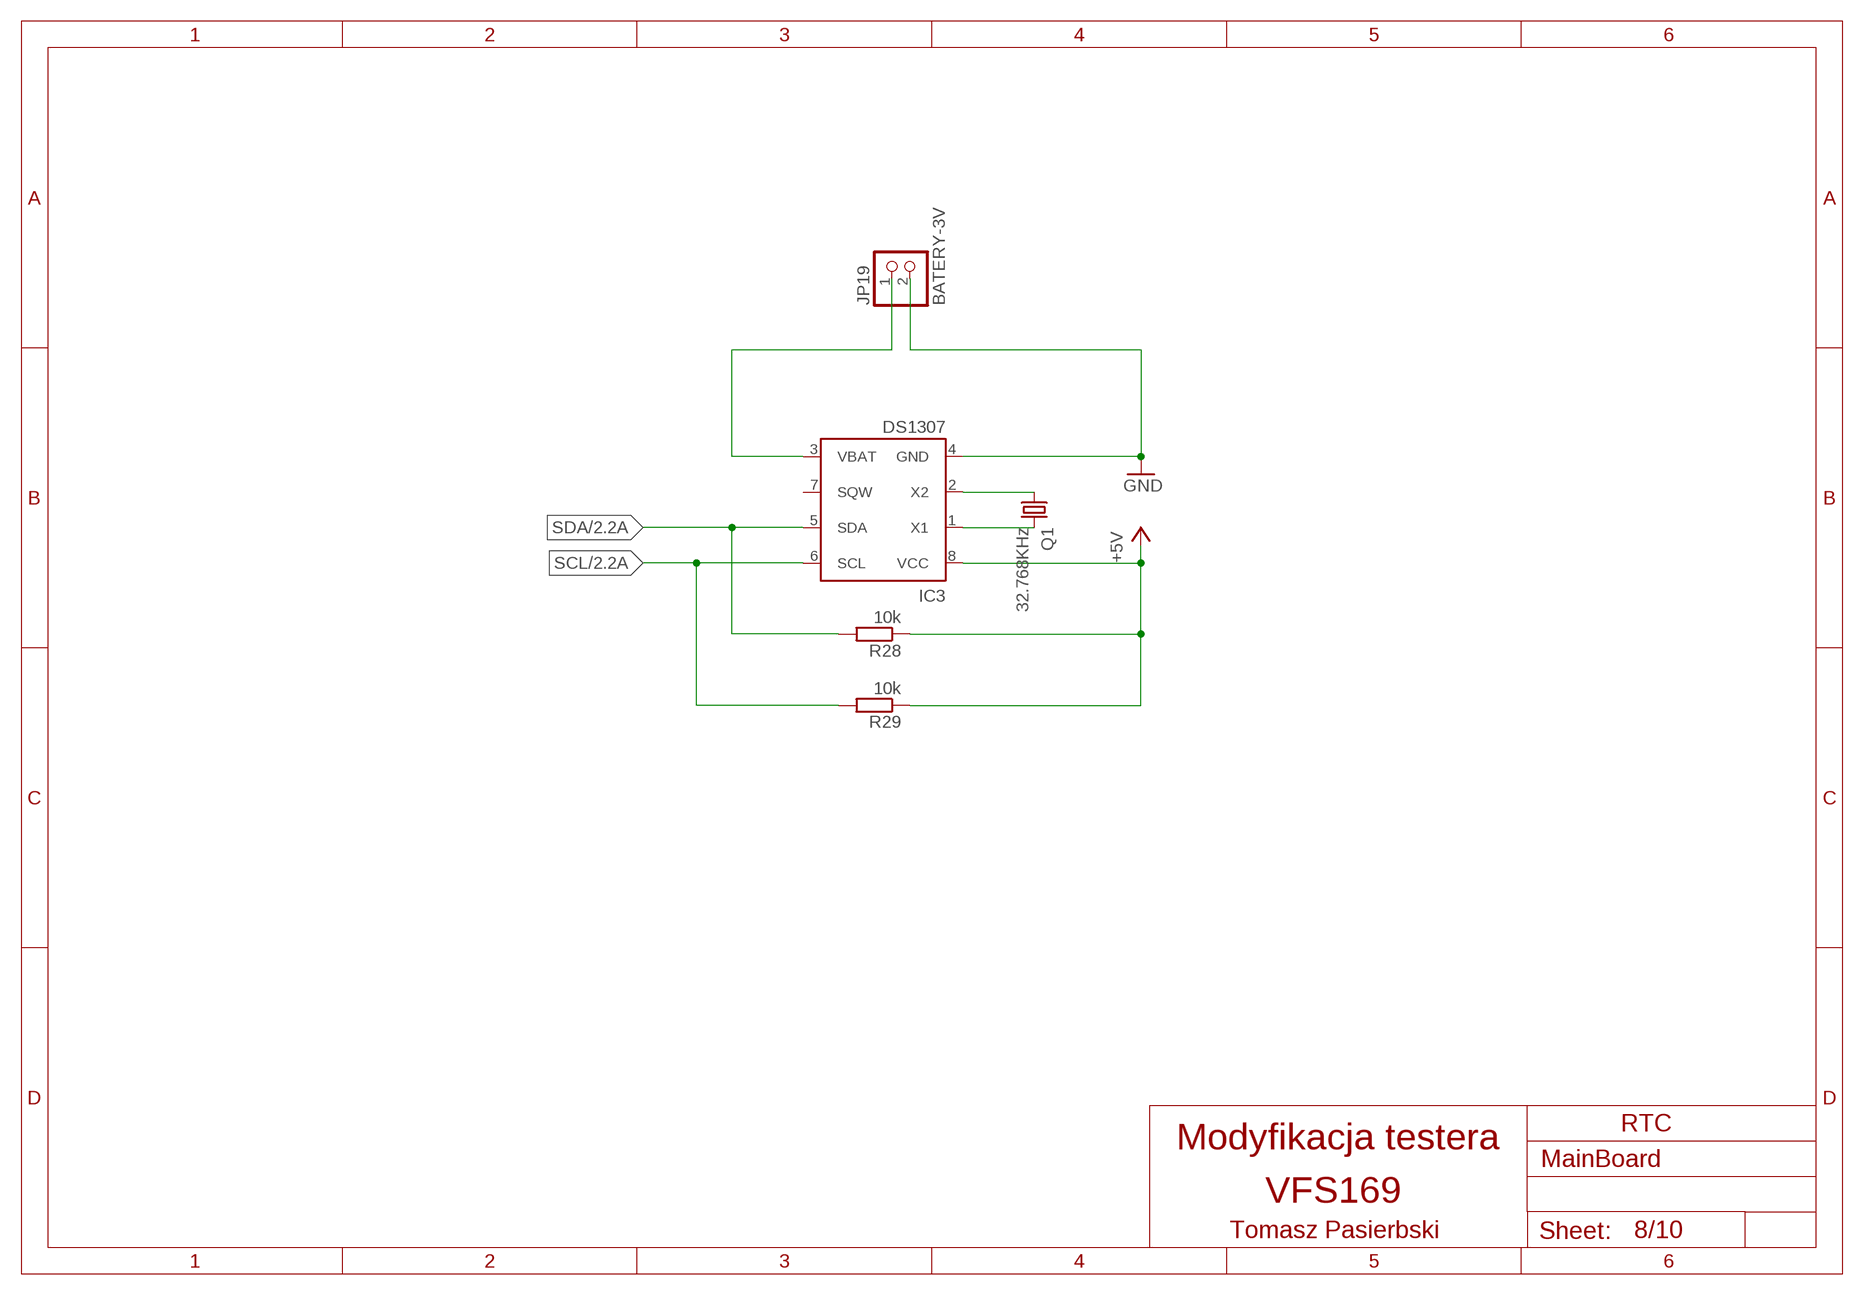
[diagram p7: schematic, sheet 8]

### Parts
IC3  DS1307  [DIL08]
JP19  BATERY-3V  PINHD-1X2  [1X02]
Q1  32.768KHz  CRYSTALTC26H  [TC26H]
R28  10k  R-EU_0207/10  [0207/10]
R29  10k  R-EU_0207/10  [0207/10]

### Nets
+5V: IC3.8(VCC) R28.1 R29.1 ; also sheet 1,2,3,4,5,6,7,9
GND: IC3.4(GND) JP19.2 ; also sheet 1,2,3,4,5,6,7,9
N$24: IC3.1(X1) Q1.2
N$25: IC3.2(X2) Q1.1
N$26: IC3.3(VBAT) JP19.1
SCL: IC3.6(SCL) R29.2 ; also sheet 2
SDA: IC3.5(SDA) R28.2 ; also sheet 2
Unconnected: IC3.7(SQW)

### Notes on the sheet
- RTC
- Modyfikacja testera
- VFS169
- Tomasz Pasierbski

## Sheet 9 of 10
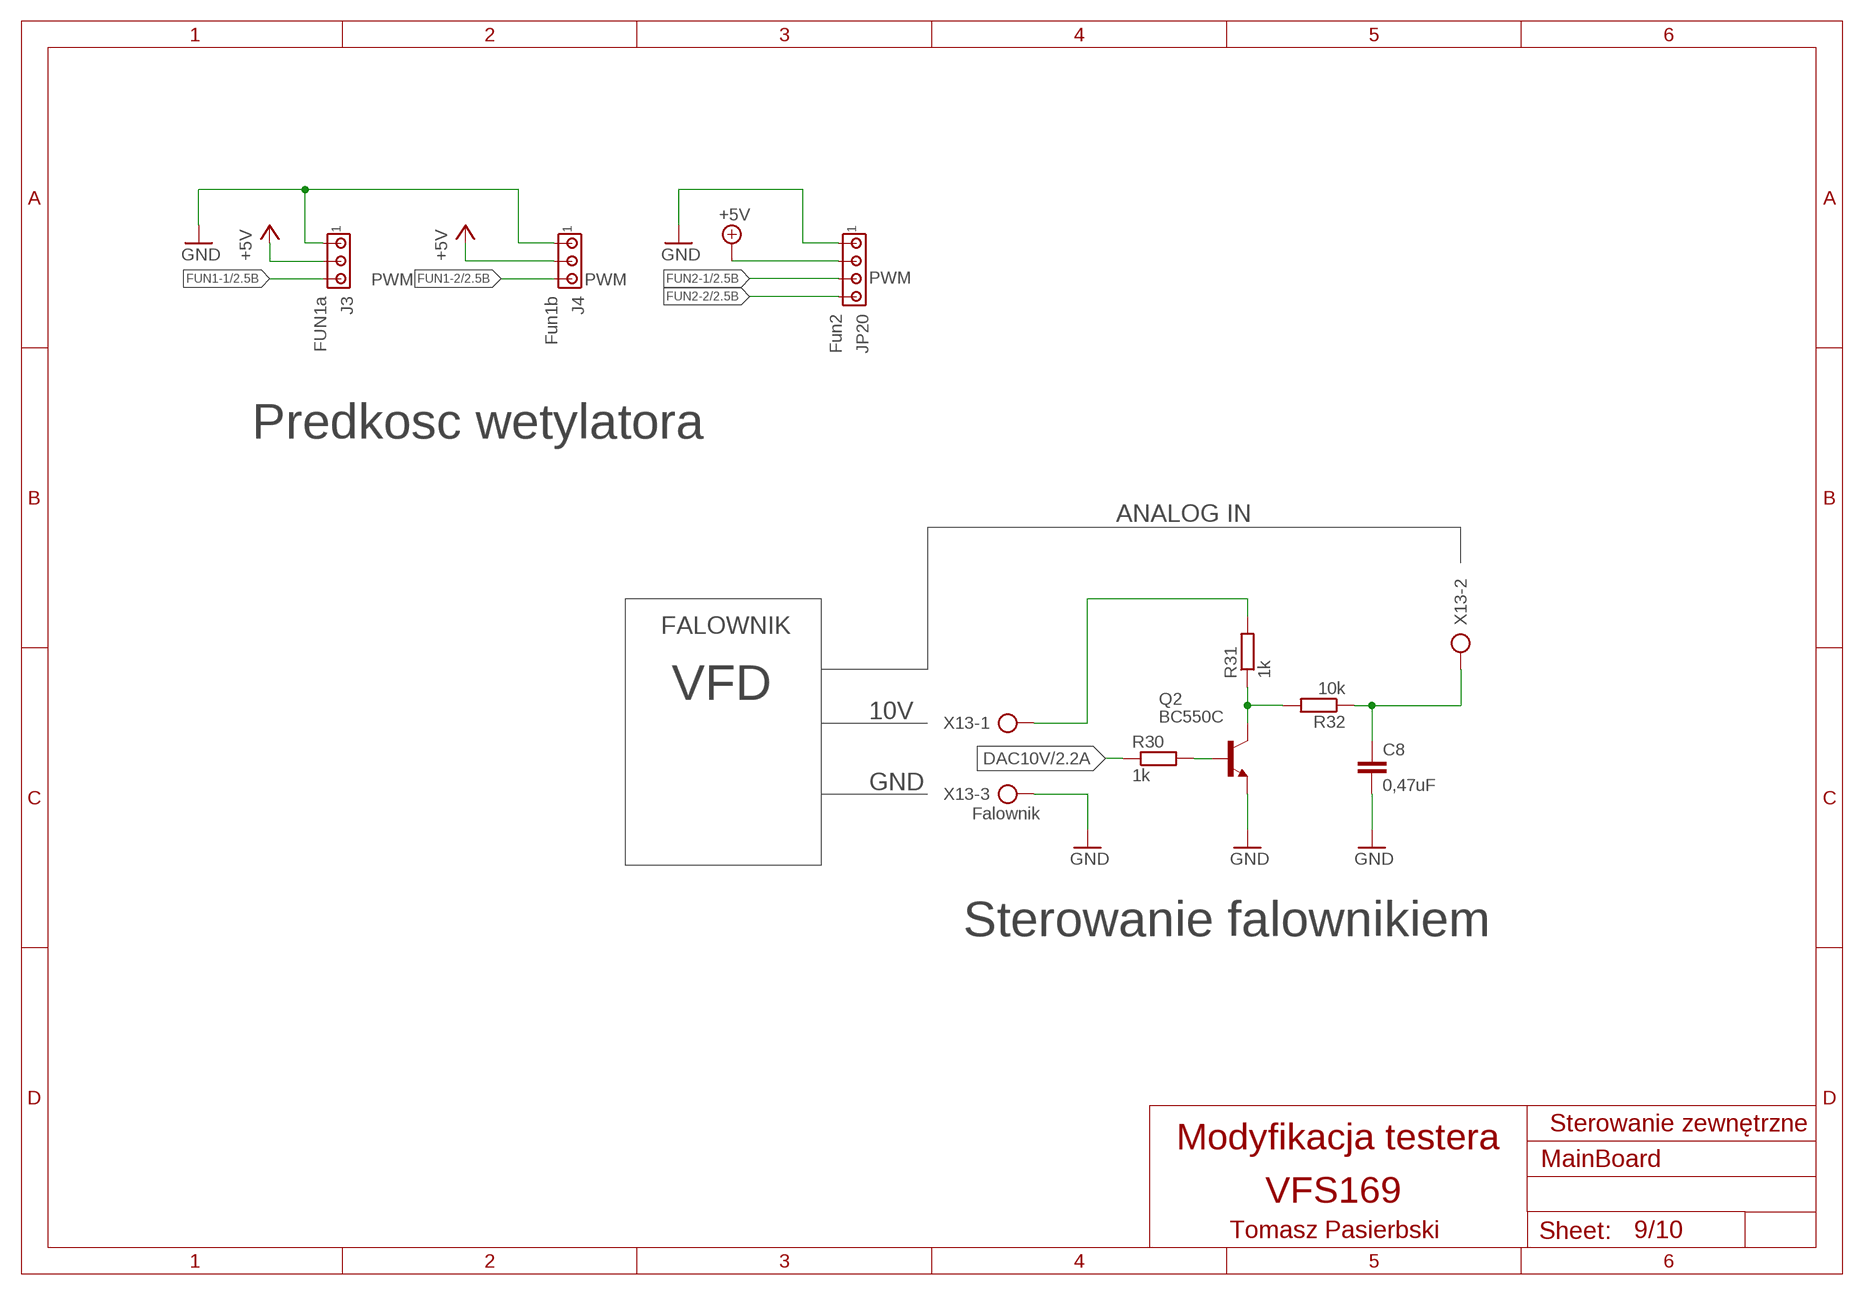
[diagram p8: schematic, sheet 9]

### Parts
C8  0,47uF  C-EU025-025X050  [C025-025X050]
J3  FUN1a  MTA03-100  [10X03MTA]
J4  Fun1b  MTA03-100  [10X03MTA]
JP20  Fun2  MTA04-100  [10X04MTA]
Q2  BC550C  [TO92-EBC]
R30  1k  R-EU_0207/10  [0207/10]
R31  1k  R-EU_0207/10  [0207/10]
R32  10k  R-EU_0207/10  [0207/10]
X13  Falownik  AK300/3  [AK300/3]

### Nets
+5V: J3.2 J4.2 JP20.2 ; also sheet 1,2,3,4,5,6,7,8
DAC10V: R30.1 ; also sheet 2
FUN1-1: J3.3 ; also sheet 2
FUN1-2: J4.3 ; also sheet 2
FUN2-1: JP20.3 ; also sheet 2
FUN2-2: JP20.4 ; also sheet 2
GND: C8.2 J3.1 J4.1 JP20.1 Q2.E X13.3 ; also sheet 1,2,3,4,5,6,7,8
N$2: R31.2 X13.1
N$6: Q2.C R31.1 R32.2
N$7: Q2.B R30.2
N$21: C8.1 R32.1 X13.2

### Notes on the sheet
- PWM | PWM | PWM
- Predkosc wetylatora
- ANALOG IN
- FALOWNIK
- VFD
- 10V
- GND
- Sterowanie falownikiem
- Sterowanie zewnętrzne
- Modyfikacja testera
- VFS169
- Tomasz Pasierbski

## Sheet 10 of 10
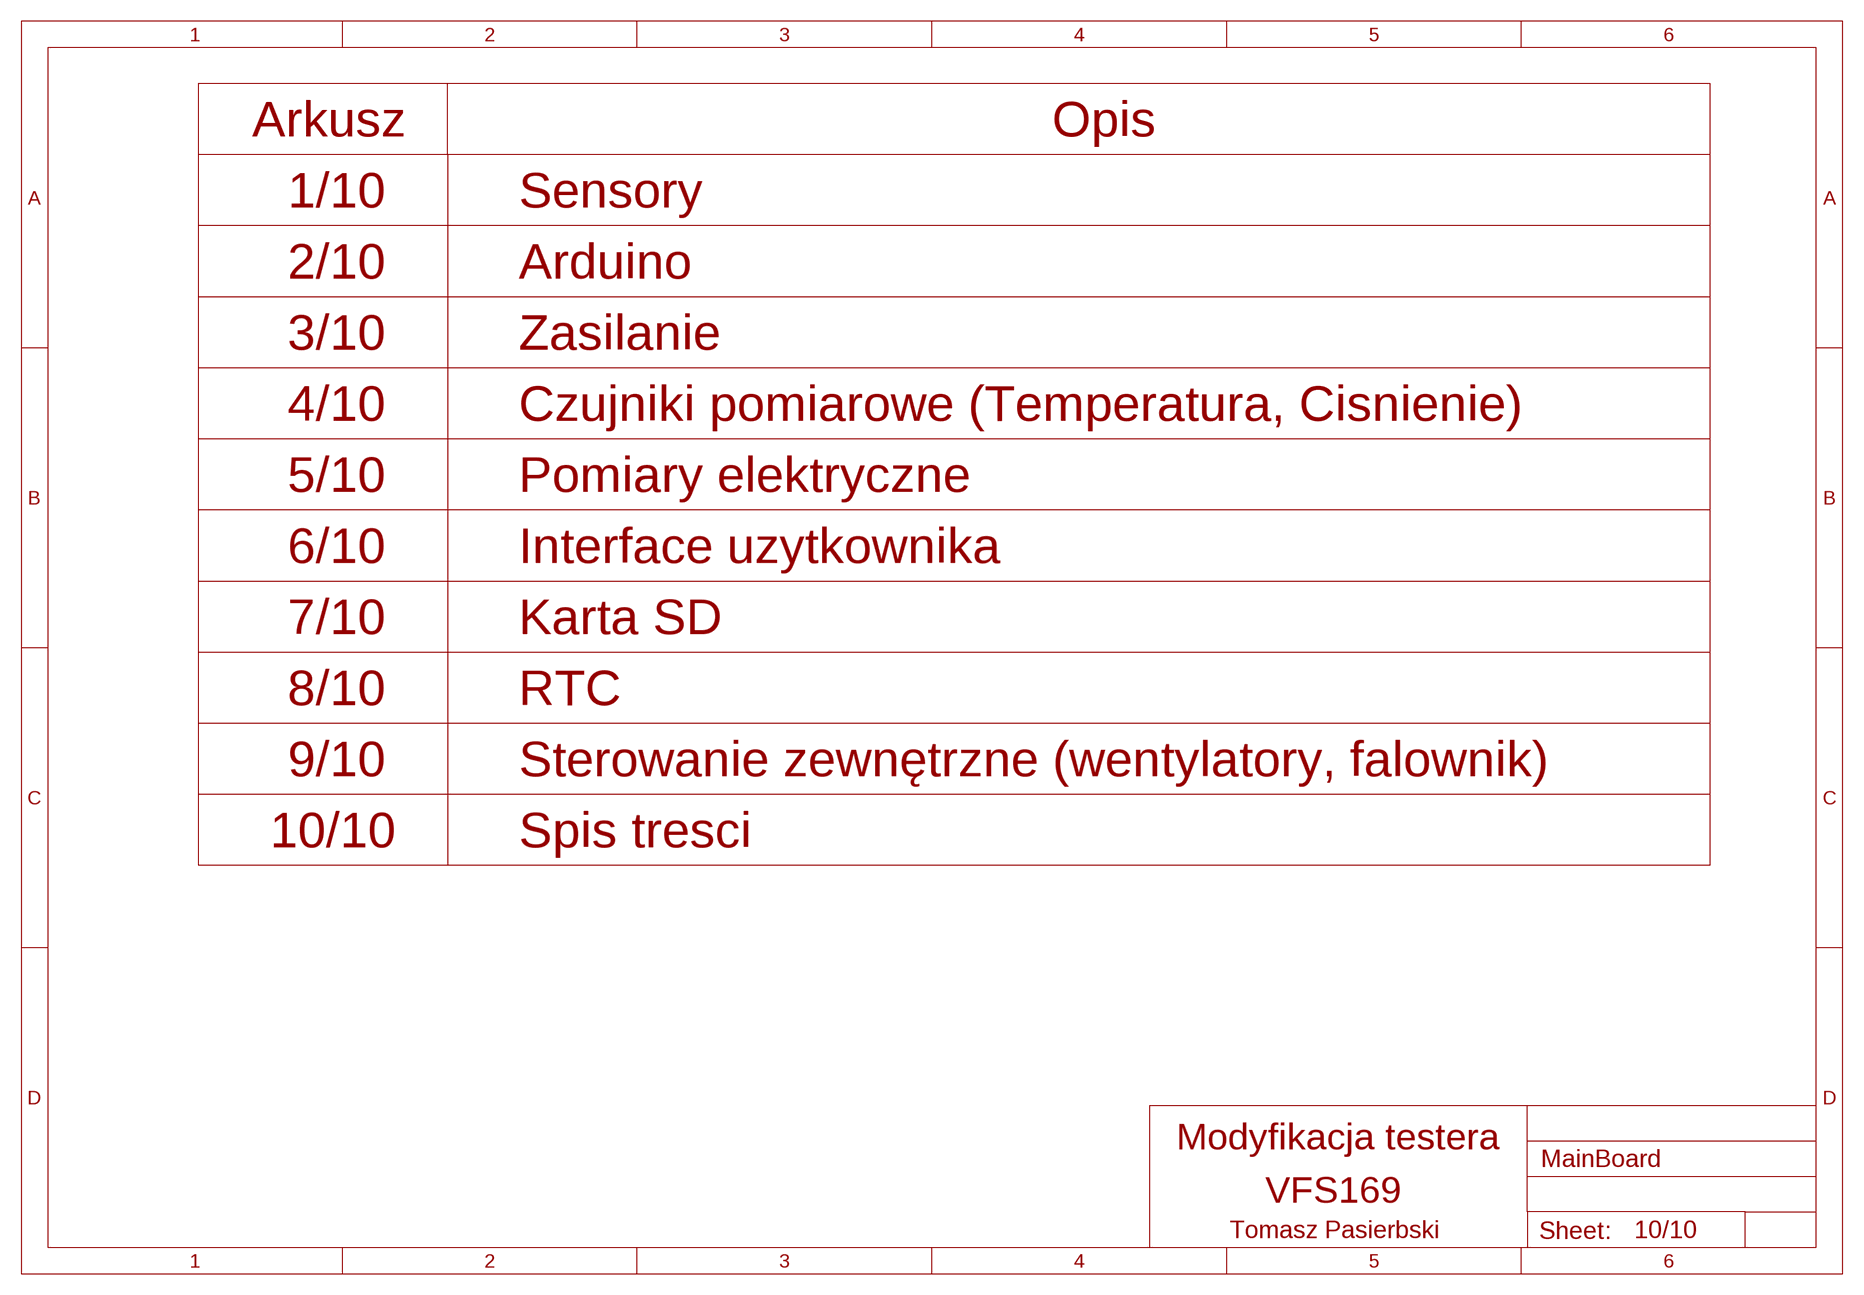
[diagram p9: schematic, sheet 10]

### Notes on the sheet
- Arkusz | Opis
- 1/10 | Sensory
- 2/10 | Arduino
- 3/10 | Zasilanie
- 4/10 | Czujniki pomiarowe (Temperatura, Cisnienie)
- 5/10 | Pomiary elektryczne
- 6/10 | Interface uzytkownika
- 7/10 | Karta SD
- 8/10 | RTC
- 9/10 | Sterowanie zewnętrzne (wentylatory, falownik)
- 10/10 | Spis tresci
- Modyfikacja testera
- VFS169
- Tomasz Pasierbski

## Library data of the parts
ADCH ADCL COMMUNICATION PWML = pinhead:PINHD-1X8: PIN HEADER
C1-C3 = rcl:CPOL-EU: POLARIZED CAPACITOR, European symbol
C4-C8 = rcl:C-EU: CAPACITOR, European symbol
D1 = diode:1N4004: DIODE general purpose rectifier, 1 A
D2 = diode:ZENER-DIODE: Z-Diode
F1 = fuse:FUSE: Fuse; OC_FARNELL: unknown; OC_NEWARK: unknown
H1-H4 = holes:MOUNT-HOLE: MOUNTING HOLE with drill center marker
IC1 IC4 = linear:78*: Positive VOLTAGE REGULATOR Source: http://cache.national.com/ds/LM/LM78L05.pdf http://www.fairchildsemi.com/ds/LM/LM7805.pdf
IC2 = 74xx-eu:74*125: Quad bus BUFFER, 3-state
IC3 = ds1307_pcf8583:DS1307: I2C-Bus CLOCK/CALENDAR
J1 = con-jack:DCJ0202: DC POWER JACK Source: DCJ0202.pdf; OC_FARNELL: unknown; OC_NEWARK: unknown
J2-J4 JP1 JP5 JP6 JP8-JP12 JP14 JP15 = con-amp:MTA03-100: AMP connector
JP2 JP7 = pinhead:PINHD-1X4: PIN HEADER
JP3 JP4 JP20 = con-amp:MTA04-100: AMP connector
JP13 = pinhead:PINHD-1X10: PIN HEADER
JP16 JP19 = pinhead:PINHD-1X2: PIN HEADER
JP17 = pinhead:PINHD-1X3: PIN HEADER
JP18 = pinhead:PINHD-1X9: PIN HEADER
LD1-LD5 = led:DUOLED-RG-A: DUO LED 2 colors (red/green), 5 mm, round, common Anode www.ligitek.com or other producers.
LED1 = led:LED: LED OSRAM: - CHIPLED LG R971, LG N971, LY N971, LG Q971, LY Q971, LO R971, LY R971 LH N974, LH R974 LS Q976, LO Q976, LY Q976 LO Q996 - Hyper CHIPLED LW Q18S LB Q993, LB Q99A, LB R99A - SideLED LS A670, LO A670, LY A670, LG A670, LP A670 LB A673, LV A673, LT A673, LW A673 LH A674 LY A675 LS A676, LA A676, LO A676, LY A676, LW A676 LS A679, LY A679, LG A679 - Hyper Micro SIDELED® LS Y876, LA Y876, LO Y876, LY Y876 LT Y87S - SmartLED LW L88C, LW L88S LB L89C, LB L89S, LG L890 LS L89K, LO L89K, LY L89K LS L896, LA L896, LO L896, LY L896 - TOPLED LS T670, LO T670, LY T670, LG T670, LP T670 LSG T670, LSP T670, LSY T670, LOP T670, LYG T670 LG T671, LOG T671, LSG T671 LB T673, LV T673, LT T673, LW T673 LH T674 LS T676, LA T676, LO T676, LY T676, LB T676, LH T676, LSB T676, LW T676 LB T67C, LV T67C, LT T67C, LS T67K, LO T67K, LY T67K, LW E67C LS E67B, LA E67B, LO E67B, LY E67B, LB E67C, LV E67C, LT E67C LW T67C LS T679, LY T679, LG T679 LS T770, LO T770, LY T770, LG T770, LP T770 LB T773, LV T773, LT T773, LW T773 LH T774 LS E675, LA E675, LY E675, LS T675 LS T776, LA T776, LO T776, LY T776, LB T776 LHGB T686 LT T68C, LB T68C - Hyper Mini TOPLED® LB M676 - Mini TOPLED Santana® LG M470 LS M47K, LO M47K, LY M47K Source: http://www.osram.convergy.de LUXEON: - LUMILED® LXK2-PW12-R00, LXK2-PW12-S00, LXK2-PW14-U00, LXK2-PW14-V00 LXK2-PM12-R00, LXK2-PM12-S00, LXK2-PM14-U00 LXK2-PE12-Q00, LXK2-PE12-R00, LXK2-PE12-S00, LXK2-PE14-T00, LXK2-PE14-U00 LXK2-PB12-K00, LXK2-PB12-L00, LXK2-PB12-M00, LXK2-PB14-N00, LXK2-PB14-P00, LXK2-PB14-Q00 LXK2-PR12-L00, LXK2-PR12-M00, LXK2-PR14-Q00, LXK2-PR14-R00 LXK2-PD12-Q00, LXK2-PD12-R00, LXK2-PD12-S00 LXK2-PH12-R00, LXK2-PH12-S00 LXK2-PL12-P00, LXK2-PL12-Q00, LXK2-PL12-R00 Source: www.luxeon.com KINGBRIGHT: KA-3528ASYC Source: www.kingbright.com
PAD1 PAD1(12V) = wirepad:WIREPAD: Wire PAD connect wire on PCB
POWER = SmartPrj:PINHD-1X8: PIN HEADER
Q1 = crystal:CRYSTAL: CRYSTAL; OC_FARNELL: unknown; OC_NEWARK: unknown
Q2 = transistor-npn:BC550*: NPN Transistor
R1-R32 = rcl:R-EU_: RESISTOR, European symbol
S2 = switch-misc:9077-1: MARQUARDT SWITCH 9077.0100 Distributor: Buerklin <https://www.buerklin.com/default.asp?event=ShowArtikel%2812G2820%29&l=d&jump=ArtNr_12G2820>
S3-S7 = switch-omron:10-XX: OMRON SWITCH; MPN: B3F-1000; OC_FARNELL: 176432; OC_NEWARK: 36M3542
SV1 = con-harting-ml:ML10: HARTING; OC_FARNELL: unknown; OC_NEWARK: unknown
X1-X10 X13 = con-ptr500:AK300/3: CONNECTOR; OC_FARNELL: unknown; OC_NEWARK: unknown
X11 X12 X14 = con-ptr500:AK300/2: CONNECTOR; OC_FARNELL: unknown; OC_NEWARK: unknown
XIO = SmartPrj:PINHD-2X18: PIN HEADER

## Net classes
0 default: width 0.203 mm, drill 0.406 mm, clearance 0.355 mm
1 power: width 0.61 mm, drill 0.406 mm, clearance 0.203 mm
2 gnd: width 0.305 mm, drill 0.406 mm, clearance 0.203 mm
3 power usb: width 0.508 mm, drill 0.406 mm, clearance 0.203 mm